# EAGLE schematic untitled (EAGLE 9.6.2)
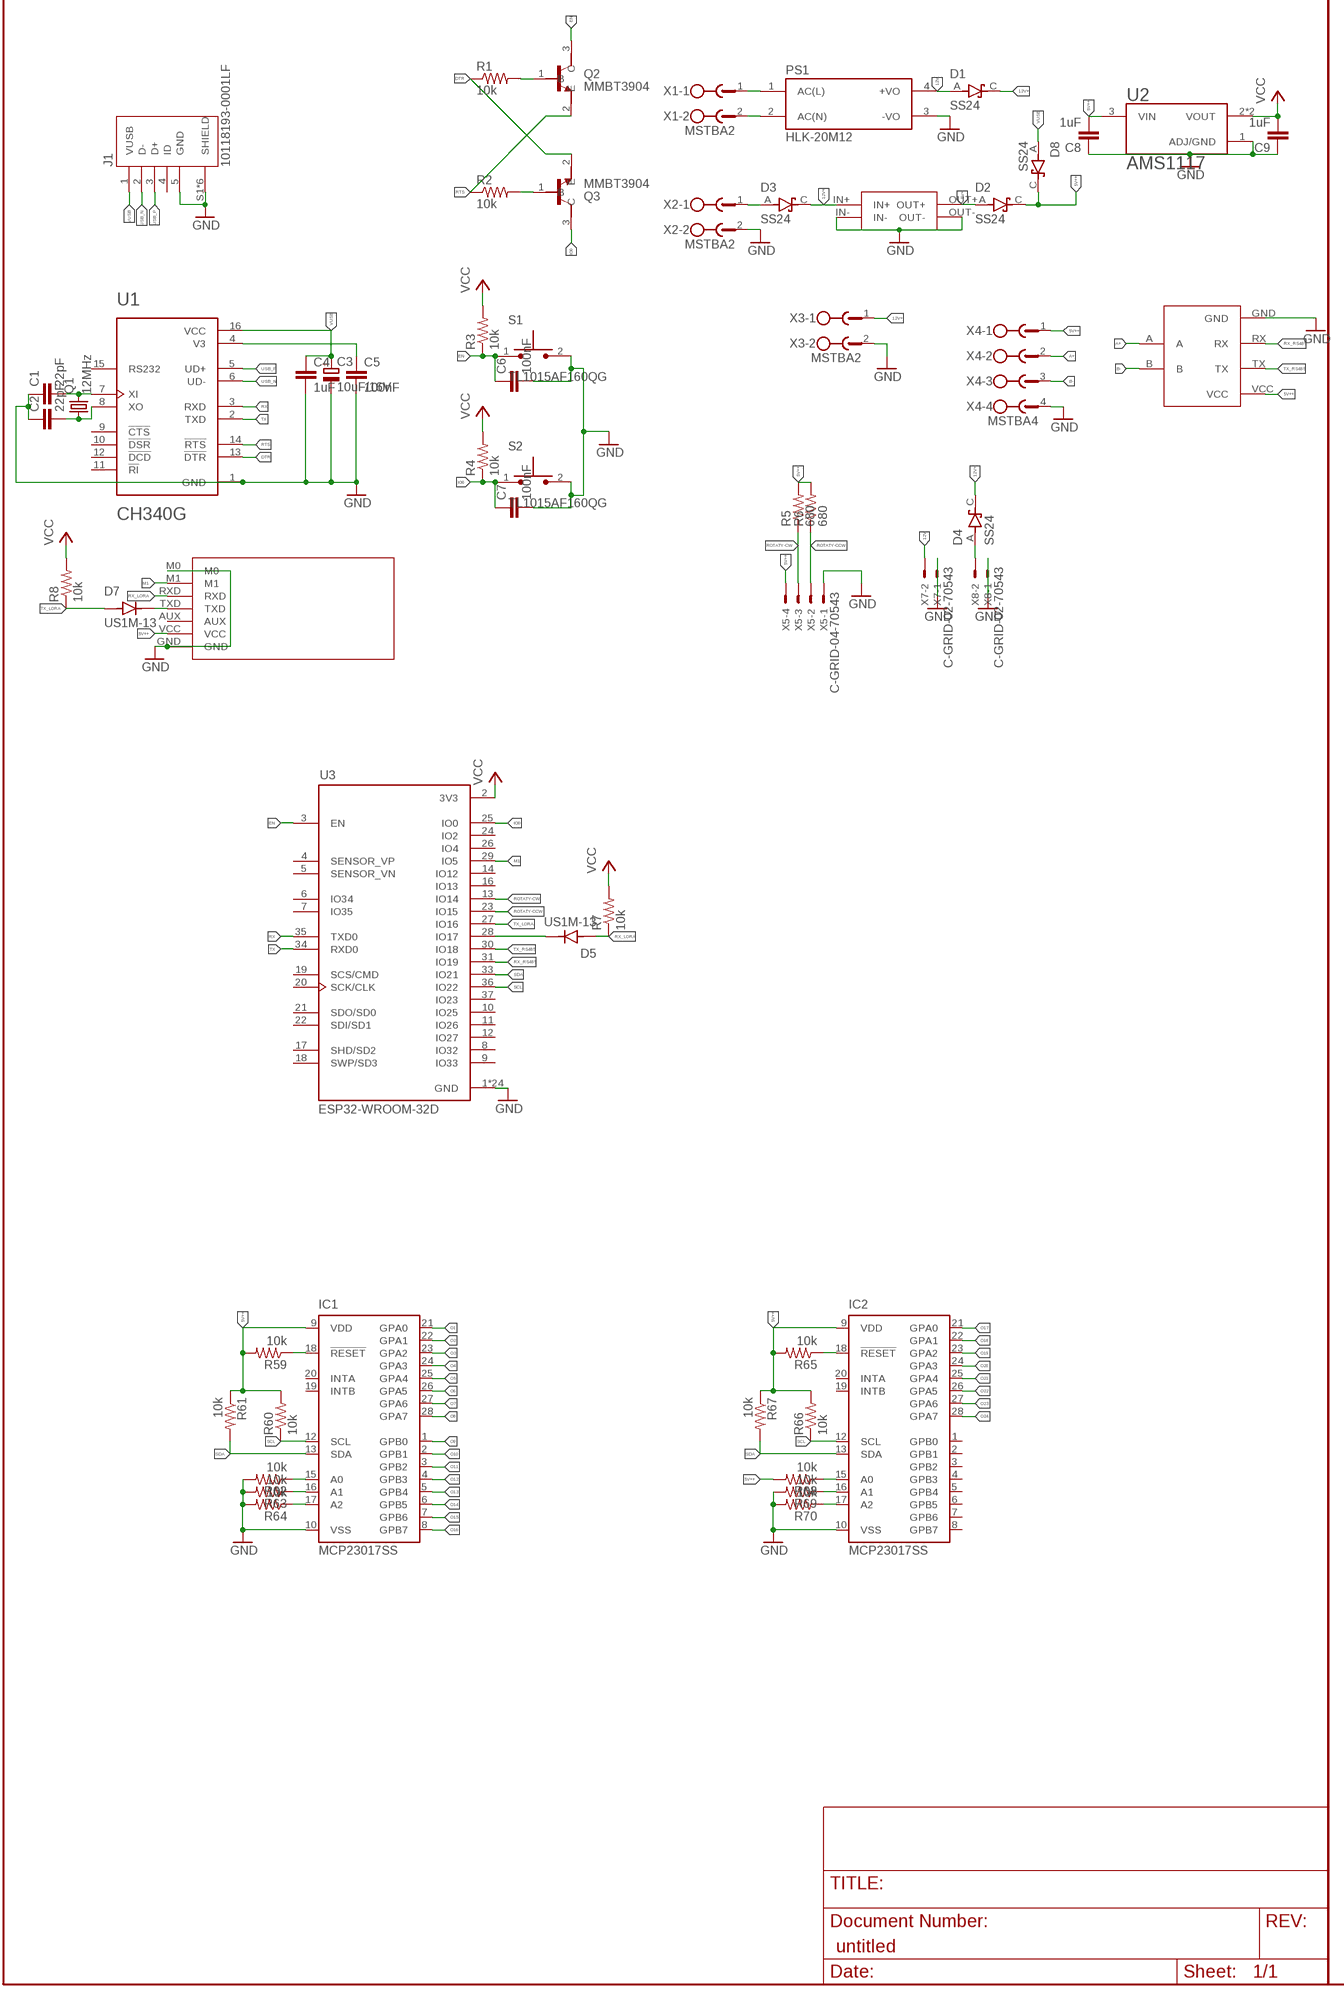
[diagram p0: schematic, sheet 1, part 1 of 2]
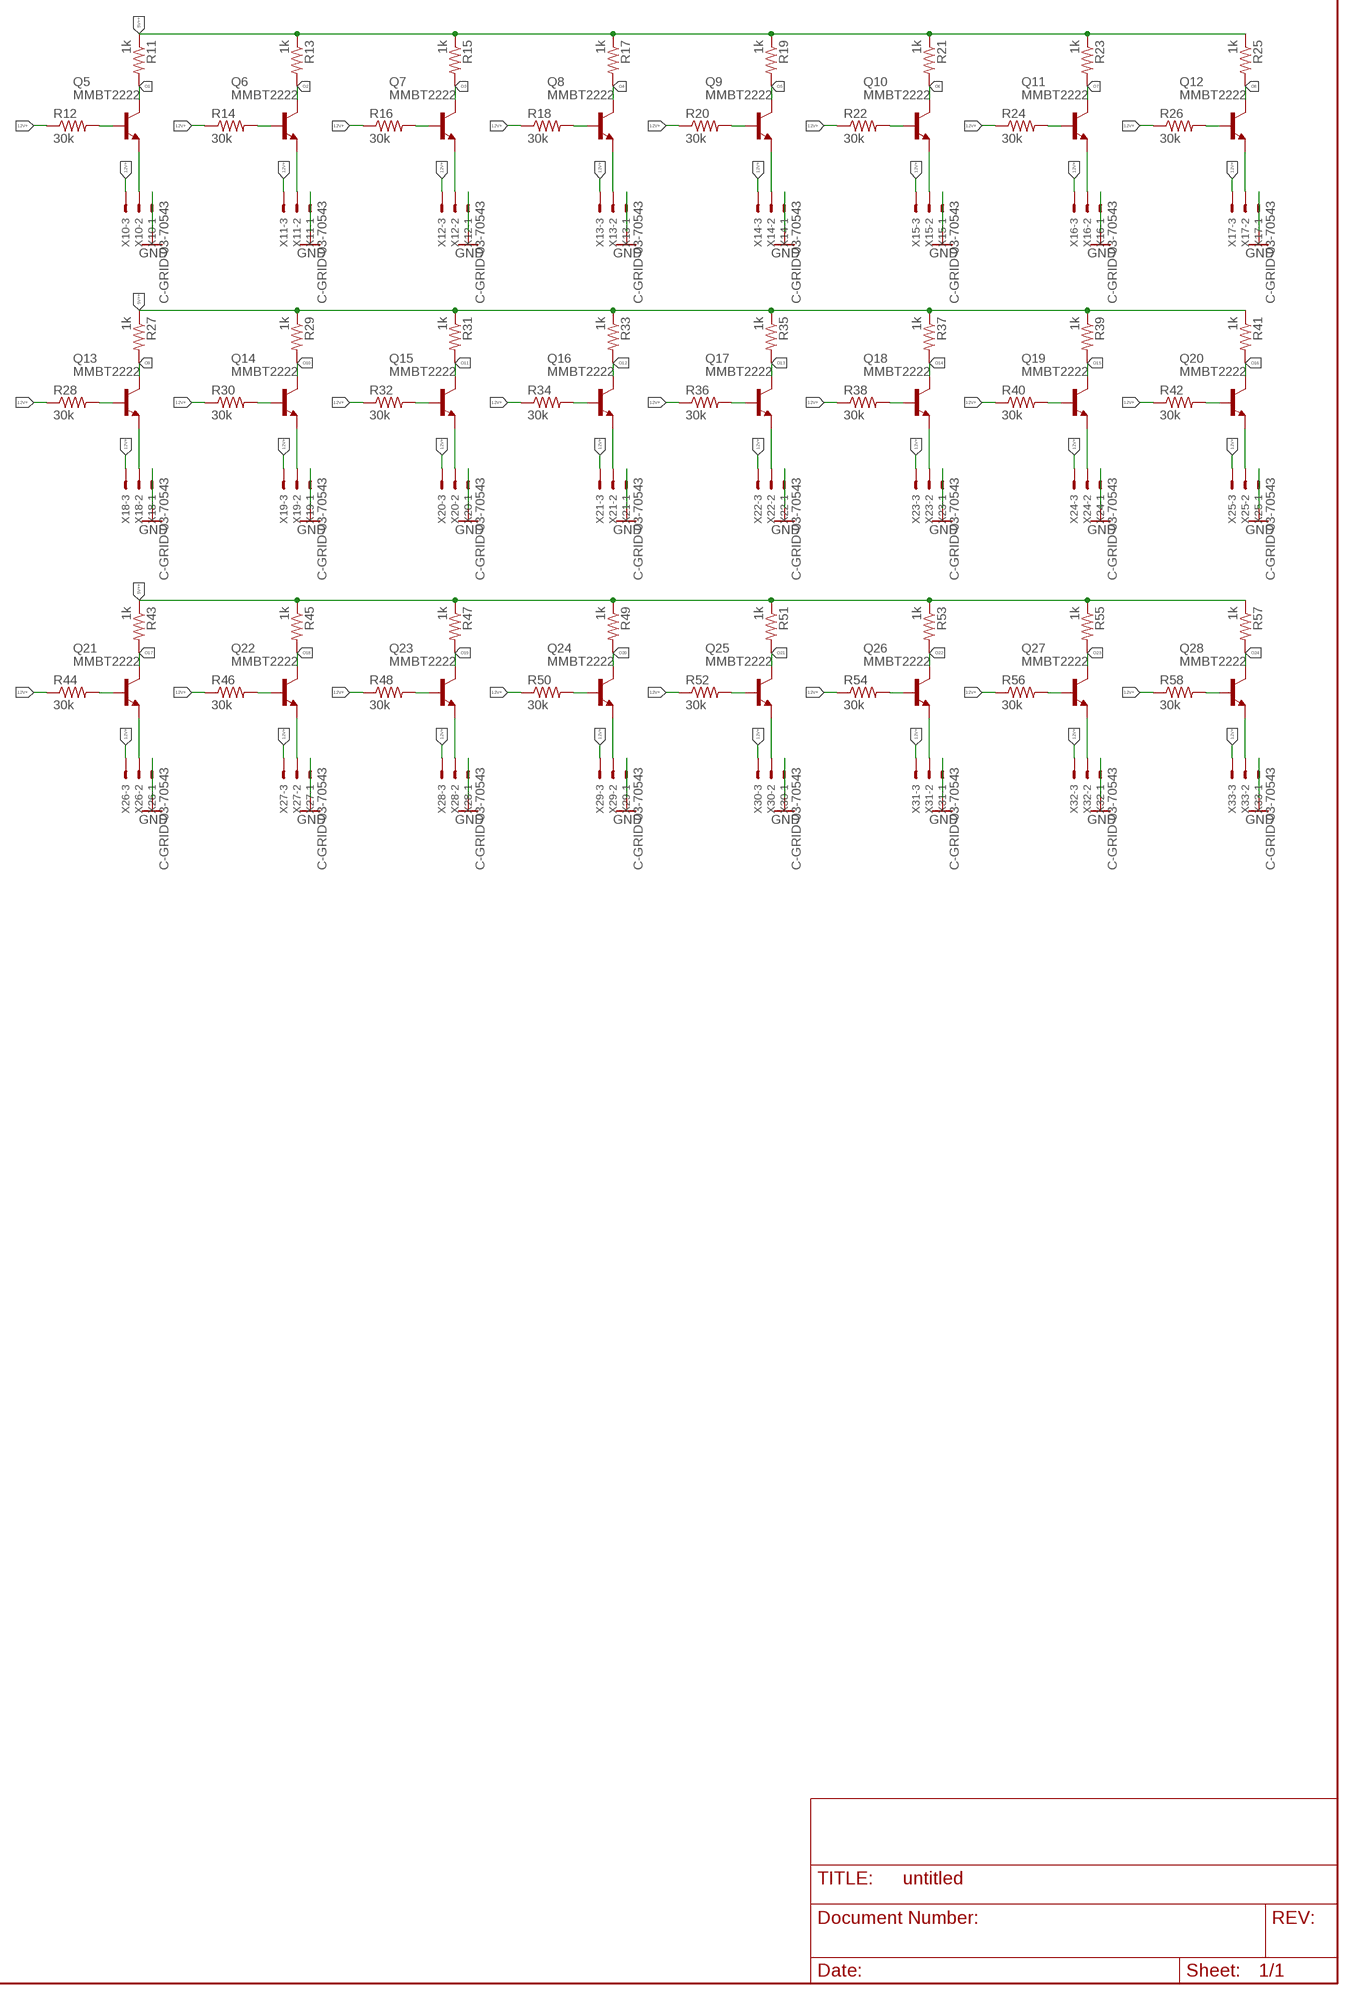
[diagram p1: schematic, sheet 1, part 2 of 2]

## Parts
C1  22pF  C-EUC0805K  [C0805K]
C2  22pF  C-EUC0805K  [C0805K]
C3  10uF/16V  CPOL-EU153CLV-0505  [153CLV-0505]
C4  1uF  C-EUC0805K  [C0805K]
C5  100nF  C-EUC0805K  [C0805K]
C6  100nF  C-EUC0805K  [C0805K]
C7  100nF  C-EUC0805K  [C0805K]
C8  1uF  C-EUC0805K  [C0805K]
C9  1uF  C-EUC0805K  [C0805K]
D1  SS24  [DIOM5336X265N]
D2  SS24  [DIOM5336X265N]
D3  SS24  [DIOM5336X265N]
D4  SS24  [DIOM5336X265N]
D5  US1M-13  [DIOM5226X240N]
D7  US1M-13  [DIOM5226X240N]
D8  SS24  [DIOM5336X265N]
EBYTEE220-900T22D1  EBYTEE220-900T22D  [EBYTEE220-900T22D]
IC1  MCP23017SS  [SSOP28]
IC2  MCP23017SS  [SSOP28]
J1  10118193-0001LF  [FCI_10118193-0001LF]
MINI1  MINI560  [MINI560]
PS1  HLK-20M12  [CONV_HLK-20M12]
Q1  12MHz  CRYSTALSM49  [SM49]
Q2  MMBT3904  [SOT95P240X120-3N]
Q3  MMBT3904  [SOT95P240X120-3N]
Q5  MMBT2222  [SOT23-BEC]
Q6  MMBT2222  [SOT23-BEC]
Q7  MMBT2222  [SOT23-BEC]
Q8  MMBT2222  [SOT23-BEC]
Q9  MMBT2222  [SOT23-BEC]
Q10  MMBT2222  [SOT23-BEC]
Q11  MMBT2222  [SOT23-BEC]
Q12  MMBT2222  [SOT23-BEC]
Q13  MMBT2222  [SOT23-BEC]
Q14  MMBT2222  [SOT23-BEC]
Q15  MMBT2222  [SOT23-BEC]
Q16  MMBT2222  [SOT23-BEC]
Q17  MMBT2222  [SOT23-BEC]
Q18  MMBT2222  [SOT23-BEC]
Q19  MMBT2222  [SOT23-BEC]
Q20  MMBT2222  [SOT23-BEC]
Q21  MMBT2222  [SOT23-BEC]
Q22  MMBT2222  [SOT23-BEC]
Q23  MMBT2222  [SOT23-BEC]
Q24  MMBT2222  [SOT23-BEC]
Q25  MMBT2222  [SOT23-BEC]
Q26  MMBT2222  [SOT23-BEC]
Q27  MMBT2222  [SOT23-BEC]
Q28  MMBT2222  [SOT23-BEC]
R1  10k  R-US_M0805  [M0805]
R2  10k  R-US_M0805  [M0805]
R3  10k  R-US_M0805  [M0805]
R4  10k  R-US_M0805  [M0805]
R5  680  R-US_M0805  [M0805]
R6  680  R-US_M0805  [M0805]
R7  10k  R-US_M0805  [M0805]
R8  10k  R-US_M0805  [M0805]
R11  1k  R-US_M0805  [M0805]
R12  30k  R-US_M0805  [M0805]
R13  1k  R-US_M0805  [M0805]
R14  30k  R-US_M0805  [M0805]
R15  1k  R-US_M0805  [M0805]
R16  30k  R-US_M0805  [M0805]
R17  1k  R-US_M0805  [M0805]
R18  30k  R-US_M0805  [M0805]
R19  1k  R-US_M0805  [M0805]
R20  30k  R-US_M0805  [M0805]
R21  1k  R-US_M0805  [M0805]
R22  30k  R-US_M0805  [M0805]
R23  1k  R-US_M0805  [M0805]
R24  30k  R-US_M0805  [M0805]
R25  1k  R-US_M0805  [M0805]
R26  30k  R-US_M0805  [M0805]
R27  1k  R-US_M0805  [M0805]
R28  30k  R-US_M0805  [M0805]
R29  1k  R-US_M0805  [M0805]
R30  30k  R-US_M0805  [M0805]
R31  1k  R-US_M0805  [M0805]
R32  30k  R-US_M0805  [M0805]
R33  1k  R-US_M0805  [M0805]
R34  30k  R-US_M0805  [M0805]
R35  1k  R-US_M0805  [M0805]
R36  30k  R-US_M0805  [M0805]
R37  1k  R-US_M0805  [M0805]
R38  30k  R-US_M0805  [M0805]
R39  1k  R-US_M0805  [M0805]
R40  30k  R-US_M0805  [M0805]
R41  1k  R-US_M0805  [M0805]
R42  30k  R-US_M0805  [M0805]
R43  1k  R-US_M0805  [M0805]
R44  30k  R-US_M0805  [M0805]
R45  1k  R-US_M0805  [M0805]
R46  30k  R-US_M0805  [M0805]
R47  1k  R-US_M0805  [M0805]
R48  30k  R-US_M0805  [M0805]
R49  1k  R-US_M0805  [M0805]
R50  30k  R-US_M0805  [M0805]
R51  1k  R-US_M0805  [M0805]
R52  30k  R-US_M0805  [M0805]
R53  1k  R-US_M0805  [M0805]
R54  30k  R-US_M0805  [M0805]
R55  1k  R-US_M0805  [M0805]
R56  30k  R-US_M0805  [M0805]
R57  1k  R-US_M0805  [M0805]
R58  30k  R-US_M0805  [M0805]
R59  10k  R-US_M0805  [M0805]
R60  10k  R-US_M0805  [M0805]
R61  10k  R-US_M0805  [M0805]
R62  10k  R-US_M0805  [M0805]
R63  10k  R-US_M0805  [M0805]
R64  10k  R-US_M0805  [M0805]
R65  10k  R-US_M0805  [M0805]
R66  10k  R-US_M0805  [M0805]
R67  10k  R-US_M0805  [M0805]
R68  10k  R-US_M0805  [M0805]
R69  10k  R-US_M0805  [M0805]
R70  10k  R-US_M0805  [M0805]
S1  TL1015AF160QG  [SW_TL1015AF160QG]
S2  TL1015AF160QG  [SW_TL1015AF160QG]
TTL-RS1  TTL-RS485  [TTL-RS485]
U1  CH340G  [SOIC127P600X180-16N]
U2  AMS1117  [SOT229P700X180-4N]
U3  ESP32-WROOM-32D  [MODULE_ESP32-WROOM-32D]
X1  MSTBA2  [MSTBA2]
X2  MSTBA2  [MSTBA2]
X3  MSTBA2  [MSTBA2]
X4  MSTBA4  [MSTBA4]
X5  C-GRID-04-70543  [70543-04]
X7  C-GRID-02-70543  [70543-02]
X8  C-GRID-02-70543  [70543-02]
X10  C-GRID-03-70543  [70543-03]
X11  C-GRID-03-70543  [70543-03]
X12  C-GRID-03-70543  [70543-03]
X13  C-GRID-03-70543  [70543-03]
X14  C-GRID-03-70543  [70543-03]
X15  C-GRID-03-70543  [70543-03]
X16  C-GRID-03-70543  [70543-03]
X17  C-GRID-03-70543  [70543-03]
X18  C-GRID-03-70543  [70543-03]
X19  C-GRID-03-70543  [70543-03]
X20  C-GRID-03-70543  [70543-03]
X21  C-GRID-03-70543  [70543-03]
X22  C-GRID-03-70543  [70543-03]
X23  C-GRID-03-70543  [70543-03]
X24  C-GRID-03-70543  [70543-03]
X25  C-GRID-03-70543  [70543-03]
X26  C-GRID-03-70543  [70543-03]
X27  C-GRID-03-70543  [70543-03]
X28  C-GRID-03-70543  [70543-03]
X29  C-GRID-03-70543  [70543-03]
X30  C-GRID-03-70543  [70543-03]
X31  C-GRID-03-70543  [70543-03]
X32  C-GRID-03-70543  [70543-03]
X33  C-GRID-03-70543  [70543-03]

## Nets
5V+: D2.A MINI1.OUT+
5V++: C8.2 D2.C(K) D8.C(K) EBYTEE220-900T22D1.VCC IC1.9(VDD) IC2.9(VDD) R5.2 R6.2 R11.1 R13.1 R15.1 R17.1 R19.1 R21.1 R23.1 R25.1 R27.1 R29.1 R31.1 R33.1 R35.1 R37.1 R39.1 R41.1 R43.1 R45.1 R47.1 R49.1 R51.1 R53.1 R55.1 R57.1 R59.2 R60.2 R61.1 R65.2 R66.2 R67.1 R68.2 TTL-RS1.VCC U2.3(VIN) X4.1 X5.4
12V: D1.A PS1.4(+VO) X7.2
12V+: D1.C(K) D3.C(K) D4.C(K) MINI1.IN+ R12.1 R14.1 R16.1 R18.1 R20.1 R22.1 R24.1 R26.1 R28.1 R30.1 R32.1 R34.1 R36.1 R38.1 R40.1 R42.1 R44.1 R46.1 R48.1 R50.1 R52.1 R54.1 R56.1 R58.1 X3.1 X10.3 X11.3 X12.3 X13.3 X14.3 X15.3 X16.3 X17.3 X18.3 X19.3 X20.3 X21.3 X22.3 X23.3 X24.3 X25.3 X26.3 X27.3 X28.3 X29.3 X30.3 X31.3 X32.3 X33.3
A+: TTL-RS1.A X4.2
B-: TTL-RS1.B X4.3
DTR: Q3.2(E) R1.1 U1.13(!DTR)
EN: C6.1 Q2.3(C) R3.1 S1.1 U3.3(EN)
GND: C1.1 C2.1 C3.- C4.2 C5.2 C6.2 C7.2 C8.1 C9.1 EBYTEE220-900T22D1.GND EBYTEE220-900T22D1.M0 IC1.10(VSS) IC2.10(VSS) J1.5(GND) J1.S1(SHIELD) J1.S2(SHIELD) J1.S3(SHIELD) J1.S4(SHIELD) J1.S5(SHIELD) J1.S6(SHIELD) MINI1.IN- MINI1.OUT- PS1.3(-VO) R62.2 R63.2 R64.2 R69.2 R70.2 S1.2 S2.2 TTL-RS1.GND U1.1(GND) U2.1(ADJ/GND) U3.1(GND) U3.15(GND) U3.38(GND) U3.39_1(GND) U3.39_2(GND) U3.39_3(GND) U3.39_4(GND) U3.39_5(GND) U3.39_6(GND) U3.39_7(GND) U3.39_8(GND) U3.39_9(GND) U3.39_10(GND) U3.39_11(GND) U3.39_12(GND) U3.39_13(GND) U3.39_14(GND) U3.39_15(GND) U3.39_16(GND) U3.39_17(GND) U3.39_18(GND) U3.39_19(GND) U3.39_20(GND) U3.39_21(GND) X2.2 X3.2 X4.4 X5.1 X7.1 X8.1 X10.1 X11.1 X12.1 X13.1 X14.1 X15.1 X16.1 X17.1 X18.1 X19.1 X20.1 X21.1 X22.1 X23.1 X24.1 X25.1 X26.1 X27.1 X28.1 X29.1 X30.1 X31.1 X32.1 X33.1
IO0: C7.1 Q3.3(C) R4.1 S2.1 U3.25(IO0)
M1: EBYTEE220-900T22D1.M1 U3.29(IO5)
N$1: D5.C(K) U3.28(IO17)
N$2: C5.1 U1.4(V3)
N$3: Q2.1(B) R1.2
N$4: C1.2 Q1.2 U1.7(XI)
N$5: C2.2 Q1.1 U1.8(XO)
N$6: Q3.1(B) R2.2
N$7: PS1.1(AC(L)) X1.1
N$8: PS1.2(AC(N)) X1.2
N$10: D3.A X2.1
N$12: D4.A X8.2
N$17: Q5.B R12.2
N$18: IC2.18(!RESET) R65.1
N$19: Q5.E X10.2
N$20: D7.C(K) EBYTEE220-900T22D1.TXD
N$21: Q6.B R14.2
N$22: IC1.18(!RESET) R59.1
N$23: Q6.E X11.2
N$24: Q7.B R16.2
N$25: IC1.15(A0) R62.1
N$26: Q7.E X12.2
N$27: Q8.B R18.2
N$28: IC1.16(A1) R63.1
N$29: Q8.E X13.2
N$30: Q9.B R20.2
N$31: IC1.17(A2) R64.1
N$32: Q9.E X14.2
N$33: Q10.B R22.2
N$34: IC2.15(A0) R68.1
N$35: Q10.E X15.2
N$36: Q11.B R24.2
N$37: IC2.16(A1) R69.1
N$38: Q11.E X16.2
N$39: Q12.B R26.2
N$40: IC2.17(A2) R70.1
N$41: Q12.E X17.2
N$42: Q13.B R28.2
N$44: Q13.E X18.2
N$45: Q14.B R30.2
N$47: Q14.E X19.2
N$48: Q15.B R32.2
N$50: Q15.E X20.2
N$51: Q16.B R34.2
N$53: Q16.E X21.2
N$54: Q17.B R36.2
N$56: Q17.E X22.2
N$57: Q18.B R38.2
N$59: Q18.E X23.2
N$60: Q19.B R40.2
N$62: Q19.E X24.2
N$63: Q20.B R42.2
N$65: Q20.E X25.2
N$66: Q21.B R44.2
N$68: Q21.E X26.2
N$69: Q22.B R46.2
N$71: Q22.E X27.2
N$72: Q23.B R48.2
N$74: Q23.E X28.2
N$75: Q24.B R50.2
N$77: Q24.E X29.2
N$78: Q25.B R52.2
N$80: Q25.E X30.2
N$81: Q26.B R54.2
N$83: Q26.E X31.2
N$84: Q27.B R56.2
N$86: Q27.E X32.2
N$87: Q28.B R58.2
N$89: Q28.E X33.2
O1: IC1.21(GPA0) Q5.C R11.2
O2: IC1.22(GPA1) Q6.C R13.2
O3: IC1.23(GPA2) Q7.C R15.2
O4: IC1.24(GPA3) Q8.C R17.2
O5: IC1.25(GPA4) Q9.C R19.2
O6: IC1.26(GPA5) Q10.C R21.2
O7: IC1.27(GPA6) Q11.C R23.2
O8: IC1.28(GPA7) Q12.C R25.2
O9: IC1.1(GPB0) Q13.C R27.2
O10: IC1.2(GPB1) Q14.C R29.2
O11: IC1.3(GPB2) Q15.C R31.2
O12: IC1.4(GPB3) Q16.C R33.2
O13: IC1.5(GPB4) Q17.C R35.2
O14: IC1.6(GPB5) Q18.C R37.2
O15: IC1.7(GPB6) Q19.C R39.2
O16: IC1.8(GPB7) Q20.C R41.2
O17: IC2.21(GPA0) Q21.C R43.2
O18: IC2.22(GPA1) Q22.C R45.2
O19: IC2.23(GPA2) Q23.C R47.2
O20: IC2.24(GPA3) Q24.C R49.2
O21: IC2.25(GPA4) Q25.C R51.2
O22: IC2.26(GPA5) Q26.C R53.2
O23: IC2.27(GPA6) Q27.C R55.2
O24: IC2.28(GPA7) Q28.C R57.2
ROTATY-CCW: R6.1 U3.23(IO15) X5.2
ROTATY-CW: R5.1 U3.13(IO14) X5.3
RTS: Q2.2(E) R2.1 U1.14(!RTS)
RX: U1.3(RXD) U3.35(TXD0)
RX_LORA: D5.A EBYTEE220-900T22D1.RXD R7.1
RX_RS485: TTL-RS1.RX U3.31(IO19)
SCL: IC1.12(SCL) IC2.12(SCL) R60.1 R66.1 U3.36(IO22)
SDA: IC1.13(SDA) IC2.13(SDA) R61.2 R67.2 U3.33(IO21)
TX: U1.2(TXD) U3.34(RXD0)
TX_LORA: D7.A R8.1 U3.27(IO16)
TX_RS485: TTL-RS1.TX U3.30(IO18)
USB_N: J1.2(D-) U1.6(UD-)
USB_P: J1.3(D+) U1.5(UD+)
VCC: C9.2 R3.2 R4.2 R7.2 R8.2 U2.2(VOUT) U2.4(VOUT) U3.2(3V3)
VUSB: C3.+ C4.1 D8.A J1.1(VUSB) U1.16(VCC)
Unconnected: EBYTEE220-900T22D1.AUX IC1.19(INTB) IC1.20(INTA) IC2.1(GPB0) IC2.2(GPB1) IC2.3(GPB2) IC2.4(GPB3) IC2.5(GPB4) IC2.6(GPB5) IC2.7(GPB6) IC2.8(GPB7) IC2.19(INTB) IC2.20(INTA) J1.4(ID) U1.9(!CTS) U1.10(!DSR) U1.11(!RI) U1.12(!DCD) U1.15(RS232) U3.4(SENSOR_VP) U3.5(SENSOR_VN) U3.6(IO34) U3.7(IO35) U3.8(IO32) U3.9(IO33) U3.10(IO25) U3.11(IO26) U3.12(IO27) U3.14(IO12) U3.16(IO13) U3.17(SHD/SD2) U3.18(SWP/SD3) U3.19(SCS/CMD) U3.20(SCK/CLK) U3.21(SDO/SD0) U3.22(SDI/SD1) U3.24(IO2) U3.26(IO4) U3.37(IO23)

## Library data of the parts
C1 C2 C4-C9 = rcl:C-EU: CAPACITOR, European symbol; SPICEPREFIX: C
C3 = rcl:CPOL-EU: POLARIZED CAPACITOR, European symbol; SPICEPREFIX: C
D1-D4 D8 = SS24:SS24: Diode Schottky 40V 2A Surface Mount DO-214AA (SMB) Check availability <https://pricing.snapeda.com/parts/SS24/ON%20Semiconductor/view-part?ref=eda>; AVAILABILITY: In Stock; CHECK_PRICES: https://www.snapeda.com/parts/SS24/Onsemi/view-part/?ref=eda; DESCRIPTION: Diode Schottky 40V 2A Surface Mount DO-214AA (SMB); MF: ON Semiconductor; MP: SS24; PACKAGE: DO-214AA ON Semiconductor; PRICE: None; SNAPEDA_LINK: https://www.snapeda.com/parts/SS24/Onsemi/view-part/?ref=snap
D5 D7 = US1M-13:US1M-13: Diode, Fast Recovery, 1a, 1kv, Do-214ac-2, Full Reel Check availability <https://pricing.snapeda.com/parts/US1M-13/Diodes%20Incorporated/view-part?ref=eda>; AVAILABILITY: In Stock; DESCRIPTION: Diode Standard 1000 V 1A Surface Mount SMA; MF: Diodes Incorporated; MP: US1M-13; PACKAGE: DO-214AC-214 Diodes Incorporated; PRICE: None; PURCHASE-URL: https://pricing.snapeda.com/search/part/US1M-13/?ref=eda
EBYTEE220-900T22D1 = EByte E220-900T22D:EBYTEE220-900T22D
IC1 IC2 = adafruit:MCP23017: http://ww1.microchip.com/downloads/en/DeviceDoc/21952a.pdf Source: http://ww1.microchip.com/downloads/en/DeviceDoc/21952a.pdf
J1 = 10118193-0001LF:10118193-0001LF: Micro USB B Type Receptacle Check availability <https://pricing.snapeda.com/parts/10118193-0001LF/FCI/view-part?ref=eda>; AVAILABILITY: In Stock; DESCRIPTION: USB - micro B USB 2.0 Receptacle Connector 5 Position Surface Mount, Right Angle; Through Hole; MF: FCI; MP: 10118193-0001LF; PACKAGE: None; PRICE: None; PURCHASE-URL: https://pricing.snapeda.com/search/part/10118193-0001LF/?ref=eda
MINI1 = MINI560:MINI560
PS1 = HLK-20M12:HLK-20M12: Check availability <https://pricing.snapeda.com/parts/HLK-20M12/Hi-link/view-part?ref=eda>; AVAILABILITY: Not in stock; CHECK_PRICES: https://www.snapeda.com/parts/HLK-20M12/Hi-link/view-part/?ref=eda; DESCRIPTION: 20W ultra-small series module power supply; MF: Hi-link; MP: HLK-20M12; PACKAGE: Non-Standard Hi-link; PRICE: None; SNAPEDA_LINK: https://www.snapeda.com/parts/HLK-20M12/Hi-link/view-part/?ref=snap
Q1 = crystal:CRYSTAL: CRYSTAL; OC_FARNELL: unknown; OC_NEWARK: unknown
Q2 Q3 = MMBT3904:MMBT3904: MMBT3904 Series 40 V CE Breakdown 0.2 A NPN General Purpose Amplifier - SOT-23 Check availability <https://pricing.snapeda.com/parts/MMBT3904/ON%20Semiconductor/view-part?ref=eda>; AVAILABILITY: In Stock; DESCRIPTION: Bipolar (BJT) Transistor NPN 40 V 200 mA 300MHz 300 mW Surface Mount SOT-23-3 (TO-236); MF: ON Semiconductor; MP: MMBT3904; PACKAGE: SOT-23-3 Motorola; PRICE: None
Q5-Q28 = MMBT2222_:MMBT2222*: NPN Transistor Check availability <https://pricing.snapeda.com/parts/MMBT2222/ON%20Semiconductor/view-part?ref=eda>; AVAILABILITY: In Stock; CHECK_PRICES: https://www.snapeda.com/parts/MMBT2222/Onsemi/view-part/?ref=eda; DESCRIPTION: Bipolar (BJT) Transistor NPN 30 V 600 mA 250MHz 300 mW Surface Mount SOT-23-3 (TO-236); MF: ON Semiconductor; MP: MMBT2222; PACKAGE: SOT-23-3 Fairchild Semiconductor; PRICE: None; SNAPEDA_LINK: https://www.snapeda.com/parts/MMBT2222/Onsemi/view-part/?ref=snap
R1-R8 R11-R70 = rcl:R-US_: RESISTOR, American symbol; SPICEPREFIX: R
S1 S2 = TL1015AF160QG:TL1015AF160QG: Tactile Switch SPST-NO Top Actuated Surface Mount Check availability <https://pricing.snapeda.com/parts/TL1015AF160QG/E-Switch/view-part?ref=eda>; AVAILABILITY: In Stock; DESCRIPTION: Tactile Switch SPST-NO Top Actuated Surface Mount; MF: E-Switch; MP: TL1015AF160QG; PACKAGE: None; PRICE: None; PURCHASE-URL: https://pricing.snapeda.com/search/part/TL1015AF160QG/?ref=eda
TTL-RS1 = TTL-RS485:TTL-RS485
U1 = CH340G:CH340G: Check availability <https://pricing.snapeda.com/parts/Ch340G/WCH/view-part?ref=eda>; AVAILABILITY: Not in stock; DESCRIPTION: USB Interface Integrated Circuit; MF: WCH; MP: Ch340G; PACKAGE: None; PRICE: None
U2 = AMS1117:AMS1117: Sot223/Pkg 1-Amp 5-Volt Low Drop Out Voltage Regulatator Check availability <https://pricing.snapeda.com/parts/AMS1117/Advanced%20Monolithic%20Systems/view-part?ref=eda>; AVAILABILITY: Not in stock; DESCRIPTION: 1A LOW DROPOUT VOLTAGE REGULATOR SOT-223; MF: Advanced Monolithic Systems; MP: AMS1117; PACKAGE: SOT-223 Seeed Technology; PRICE: None
U3 = ESP32-WROOM-32D:ESP32-WROOM-32D: Bluetooth, WiFi 802.11b/g/n, Bluetooth v4.2 + EDR, Class 1, 2 and 3 Transceiver Module 2.4GHz ~ 2.5GHz Integrated, Trace Surface Mount Check availability <https://pricing.snapeda.com/parts/ESP32-WROOM-32D/Espressif%20Systems/view-part?ref=eda>; AVAILABILITY: In Stock; DESCRIPTION: Bluetooth, WiFi 802.11b/g/n, Bluetooth v4.2 +EDR, Class 1, 2 and 3 Transceiver Module 2.4GHz ~ 2.5GHz Integrated; MF: Espressif Systems; MP: ESP32-WROOM-32D; PACKAGE: Module Espressif Systems; PRICE: None; PURCHASE-URL: https://pricing.snapeda.com/search/part/ESP32-WROOM-32D/?ref=eda
X1-X3 = con-phoenix-508:MSTBA2: PHOENIX; MF: FARNELL; MPN: 1757242; OC_FARNELL: 3705171; OC_NEWARK: 71C4161
X4 = con-phoenix-508:MSTBA4: PHOENIX; MF: FARNELL; MPN: 1757268; OC_FARNELL: 3705195; OC_NEWARK: 71C4163
X5 = con-molex:C-GRID-04: CONNECTOR wire to board 2.54 mm (0.100") pitch header; MF: MOLEX; OC_FARNELL: unknown; OC_NEWARK: unknown
X7 X8 = con-molex:C-GRID-02: CONNECTOR wire to board 2.54 mm (0.100") pitch header; MF: MOLEX; OC_FARNELL: unknown; OC_NEWARK: unknown
X10-X33 = con-molex:C-GRID-03: CONNECTOR wire to board 2.54 mm (0.100") pitch header; MF: MOLEX; OC_FARNELL: unknown; OC_NEWARK: unknown